# Altium schematic sheet Connector.SchDoc: Connector
size A4; Date: 15.03.2026; Author: Vamsi Krishna Sesham; DrawnBy: Vamsi Krishna Sesham; Engineer: Vamsi Krishna Sesham; Revision: C; SheetNumber: 3; SheetTotal: 6
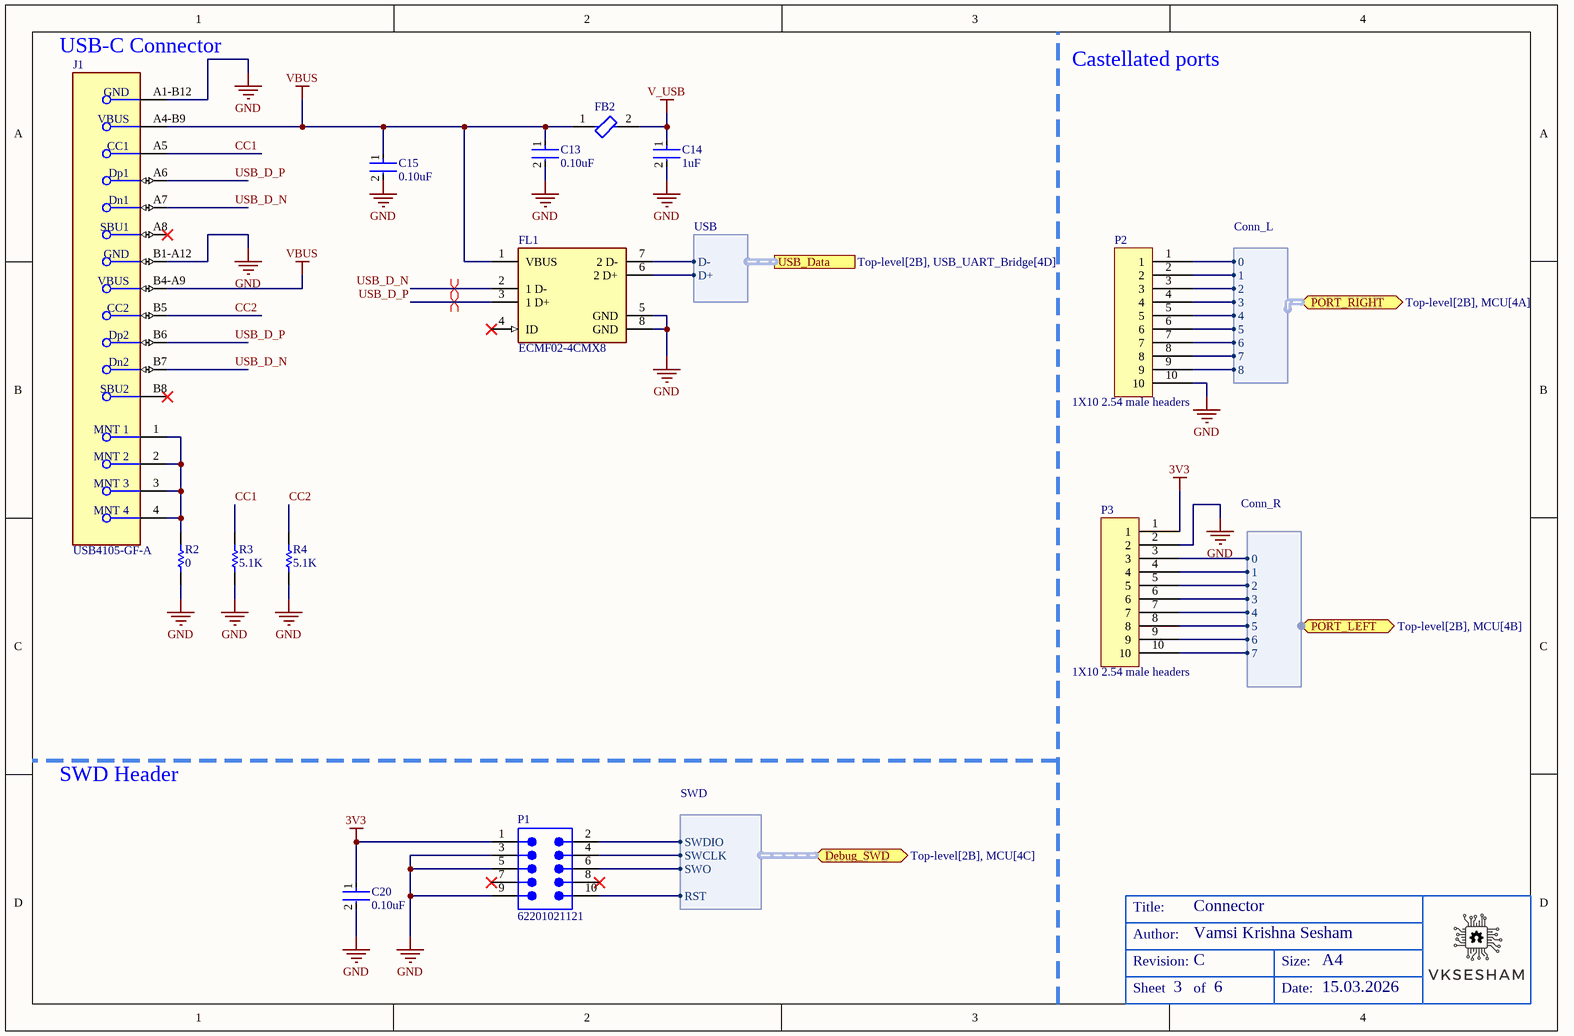
[diagram p0: Connector.SchDoc]

## Parts
*  TitleBlock  (value not drawn)  (graphical)
C13  0.10uF  [FP-GRM033-0_03-MFG]
C14  1uF  [FP-CL03-IPC_C]
C15  0.10uF  [FP-GRM033-0_03-MFG]
C20  0.10uF  [FP-GRM033-0_03-MFG]
FB2  (no value)  [FP-BLM03-0_03-d0_3-IPC_C]
FL1  ECMF02-4CMX8  [FP-Micro_QFN-8L-MFG]
J1  USB4105-GF-A  [FP-USB4105-GF-A-MFG]
P1  62201021121  [62201021121]
P2  1X10 2.54 male headers  [Male_Headers_254_1x10]  (no BOM)
P3  1X10 2.54 male headers  [Male_Headers_254_1x10]  (no BOM)
R2  0  [RESC1005X40X25NL05T10]
R3  5.1K  [RESC0603X26X15NL03T05]
R4  5.1K  [RESC0603X26X15NL03T05]

## Ports
Debug_SWD (bidir, harness SWD, see Top-level[2B], MCU[4C]), PORT_LEFT (bidir, harness Conn_R, see Top-level[2B], MCU[4B]), PORT_RIGHT (bidir, harness Conn_L, see Top-level[2B], MCU[4A]), USB_Data (harness USB, see Top-level[2B], USB_UART_Bridge[4D])

## Harnesses
USB: D-, D+
SWD: SWDIO, SWCLK, SWO, RST
Conn_R: 0, 1, 2, 3, 4, 5, 6, 7
Conn_L: 0, 1, 2, 3, 4, 5, 6, 7, 8

## Nets
3V3: C20.1 P1.1 P3.1
GND: C13.2 C14.2 C15.2 C20.2 FL1.5(GND) FL1.8(GND) J1.A1-B12(GND) J1.B1-A12(GND) P1.3 P1.5 P1.9 P2.10 P3.2 R2.1 R3.1 R4.1
V_USB: C14.1 FB2.2
VBUS: C13.1 C15.1 FB2.1 FL1.1(VBUS) J1.A4-B9(VBUS) J1.B4-A9(VBUS)
CC1: J1.A5(CC1) R3.2
CC2: J1.B5(CC2) R4.2
USB_D_N: FL1.2(1_D-) J1.A7(Dn1) J1.B7(Dn2)
USB_D_P: FL1.3(1_D+) J1.A6(Dp1) J1.B6(Dp2)
NetFL1_6: FL1.6(2_D+) ; port USB_Data.D+
NetFL1_7: FL1.7(2_D-) ; port USB_Data.D-
NetJ1_1: J1.1(MNT_1) J1.2(MNT_2) J1.3(MNT_3) J1.4(MNT_4) R2.2
NetP1_2: P1.2 ; port Debug_SWD.SWDIO
NetP1_4: P1.4 ; port Debug_SWD.SWCLK
NetP1_6: P1.6 ; port Debug_SWD.SWO
NetP1_10: P1.10 ; port Debug_SWD.RST
NetP2_1: P2.1 ; port PORT_RIGHT.0
NetP2_2: P2.2 ; port PORT_RIGHT.1
NetP2_3: P2.3 ; port PORT_RIGHT.2
NetP2_4: P2.4 ; port PORT_RIGHT.3
NetP2_5: P2.5 ; port PORT_RIGHT.4
NetP2_6: P2.6 ; port PORT_RIGHT.5
NetP2_7: P2.7 ; port PORT_RIGHT.6
NetP2_8: P2.8 ; port PORT_RIGHT.7
NetP2_9: P2.9 ; port PORT_RIGHT.8
NetP3_3: P3.3 ; port PORT_LEFT.0
NetP3_4: P3.4 ; port PORT_LEFT.1
NetP3_5: P3.5 ; port PORT_LEFT.2
NetP3_6: P3.6 ; port PORT_LEFT.3
NetP3_7: P3.7 ; port PORT_LEFT.4
NetP3_8: P3.8 ; port PORT_LEFT.5
NetP3_9: P3.9 ; port PORT_LEFT.6
NetP3_10: P3.10 ; port PORT_LEFT.7

Not connected (* = marked no-connect by the designer): FL1 4(ID)*; J1 A8(SBU1)* B8(SBU2)*; P1 7* 8*

## Layout directives
differential pair: USB_D_N, USB_D_P

## Notes on the sheet
- (near J1) USB-C Connector
- Castellated ports
- SWD Header
- (in symbol TitleBlock) Title:; Author:; Revision:; Size:; A4; Sheet; of; Date:

## Library data of the parts
C13 C15 C20 = CMP-06035-019037-1: Chip Multilayer Ceramic Capacitors for General Purpose, 0201, 0.10uF, X7S, 22%, 10%, 16V; Capacitance: 100nF; Dielectric: X7S; Tolerance: 10%; Voltage Rating (DC): 16V; Height: 0.3mm; Max Operating Temperature: 125°C; Case Code (Metric): 0603; Termination: SMD/SMT; Min Operating Temperature: -55°C; Mount: Surface Mount; Case/Package: 0201; Weight: 1.2E-05oz; Package Quantity: 15000; Length: 0.024inch; Voltage Rating: 16V; Case Code (Imperial): 0201; Packaging: Tape and Reel; Thickness: 0.013inch; Width: 0.3mm
C14 = CMP-13271-000008-1: CAP CER 1UF 16V X5R 0201; Manufacturer Part Number: CL03A105MO3NRNH; Manufacturer: Samsung Electro-Mechanics; Tolerance: 20%; Material: Ceramic; Temperature Coefficient: 15%; Automotive: No; Temperature Range High: +85°C; Temperature: -55°C to +85°C; Package: CL03; Capacitance: 1uF; Temperature Range Low: -55°C; Height: 0.39mm; ComponentLink2URL: http://www.samsungsem.com/global/front/downloadcms.do?path=%2F%2Fglobal%2F%2Fsupport%2F%2Fproduct-search%2F%2Fmlcc%2F%2F__icsFiles%2F%2Fafieldfile%2F%2F2018%2F%2F06%2F%2F21&fileName=CL03A105MO3NRNH.pdf; RoHS: TRUE; Value: 1uF; Lead Free: Yes; Voltage Rating: 16V; Octopart: https://octopart.com/cl03a105mo3nrnh-samsung-47681184; Device Class L2: Capacitors; ComponentLink2Description: Datasheet; Device Class L3: Ceramic Capacitors; Digikey Description: CAP CER 1UF 16V X5R 0201; Category: Cap; Temperature Characteristic: X5R; Device Class L1: Passive Components; Ipc Land Pattern Name: CAPC6030X30
FB2 = CMP-06046-002105-1: BLM03EB500SH1D, Ferrite Bead, 0201, 50Ω @ 100MHz, 25%, 0.58Ω, 400mA; RoHS Compliant: Yes
FL1 = CMP-12075-000002-1: COMMON MODE CHOKE 2LN SMD ESD; Number of Lines: 2; DC Resistance (DCR): 4R; Package Quantity: 3000; Case/Package: QFN; Width: 0.047inch; Mount: Surface Mount; Termination: Flat; Length: 0.098inch; Height: 0.022inch; Lead Free: Lead Free; Depth: 1.25mm; REACH SVHC: No SVHC; Max Operating Temperature: 85°C; Min Operating Temperature: -30°C; Number of Pins: 8; Packaging: Tape and Reel
J1 = CMP-245163-000001-1: CONN RCPT USB2.0 TYPEC 5A; Manufacturer: GCT; Voltage Rating: 20V; Is Female: yes; Current Rating: 5/6.25/1.25/0.25A; Number Of Contacts: 16; Conn Orientation: Right Angle; Device Class L1: Connectors; Category: Conn; Lead Free: Yes; RoHS: TRUE; Temperature Range High: +85°C; Digikey Description: CONN RCPT USB2.0 TYPEC 5A; Device Class L3: unset; ComponentLink2Description: Datasheet; Manufacturer Part Number: USB4105-GF-A; Package: 0; Usb Standard: USB 2.0; Device Class L2: USB Connectors; Automotive: No; Temperature Range Low: -40°C; Height: 3.46mm; Temperature: -40°C to +85°C; Contact Material: Gold,Nickel; ComponentLink2URL: https://gct.co/files/drawings/usb4105.pdf; Octopart: https://octopart.com/usb4105-gf-a-gct-106627878
P1 = CMP-1502-00948-3: NexarPartId: 32855586; Pitch: 1.27mm; Operating Supply Voltage: 100V; Connector Type: Male Pin; Contact Resistance: 20mΩ; Current Rating: 1A; Number of Contacts: 10; Gender: Male; Contact Mating Length: 3.81mm; Max Operating Temperature: 105°C; Mount: Through Hole; Number of Pins: 10; Row Spacing: 1.27mm; Lead Pitch: 1.27mm; REACH SVHC: Unknown; Min Operating Temperature: -40°C; Contact Material: Copper; Orientation: Vertical; Contact Plating: Gold; Number of Rows: 2; RoHS: Compliant; Packaging: Box; Voltage Rating: 100V; Color: Black; Height: 5.65mm; Termination: Solder; Number of Positions: 10
P2 P3 = Male_Headers_254_1x10
R2 = CMP-1011-00001-2: Manufacturer: Yageo / Phycomp; Part Number: RC0402JR-070RL
R3 R4 = CMP-2004-02525-1: Part Number: MCRE000157; Manufacturer: Multicomp